# EAGLE design JunoCTRL 1.3 (EAGLE 6.1)
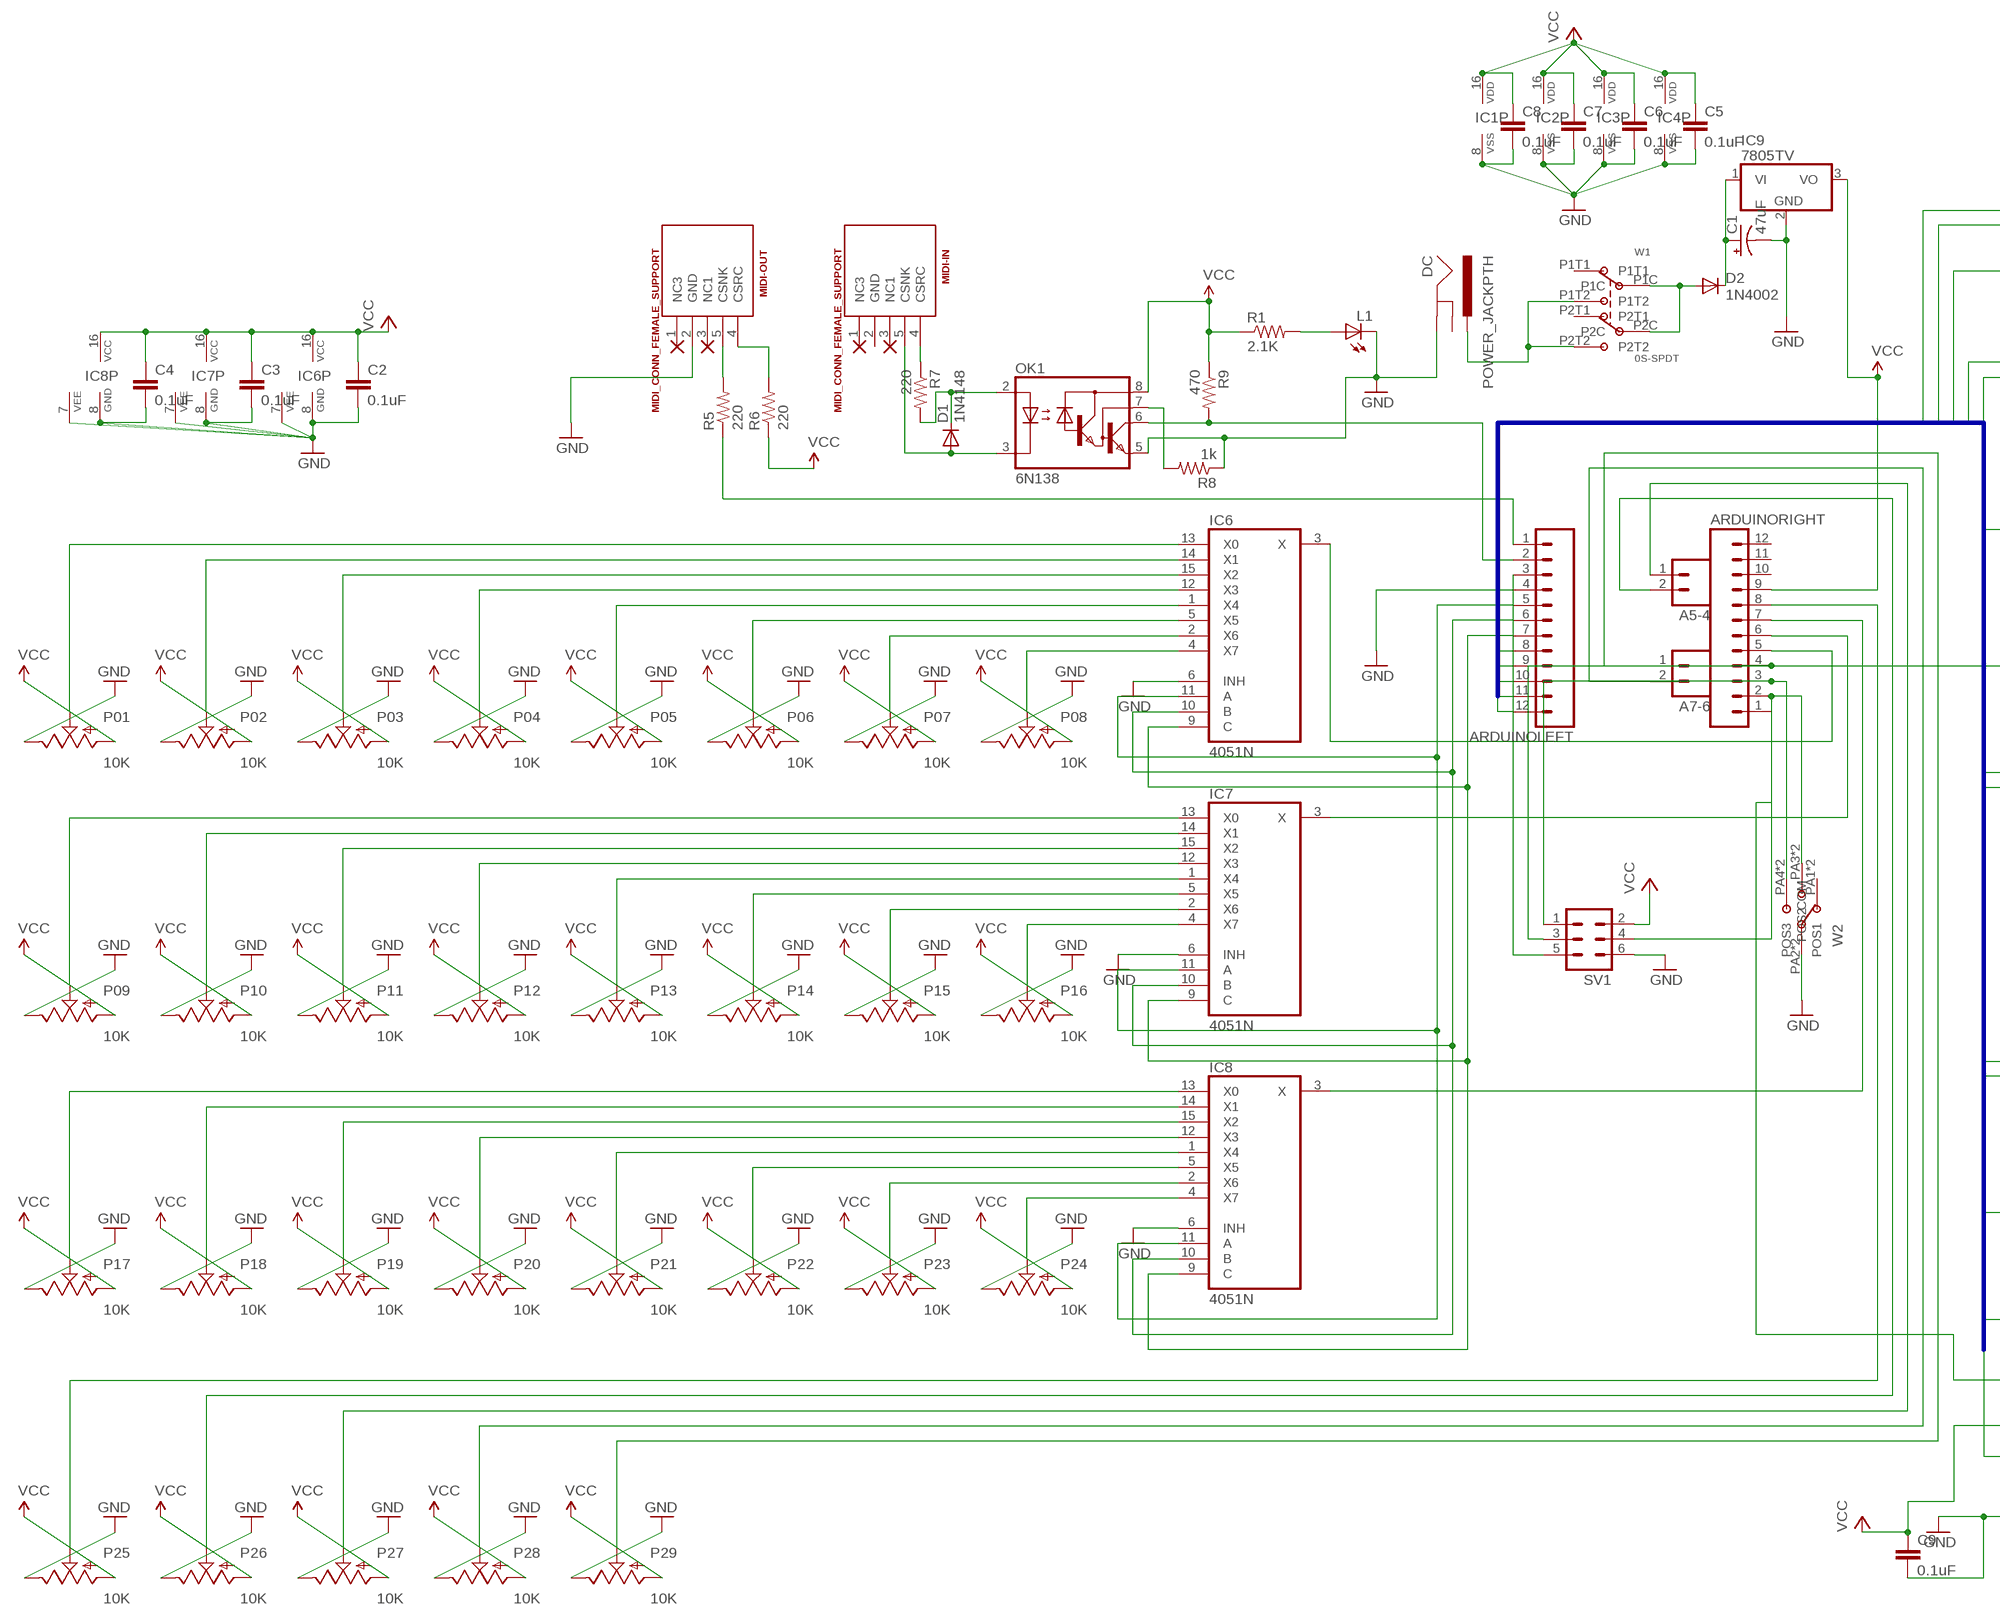
[diagram p0: schematic, sheet 1, part 1 of 2]
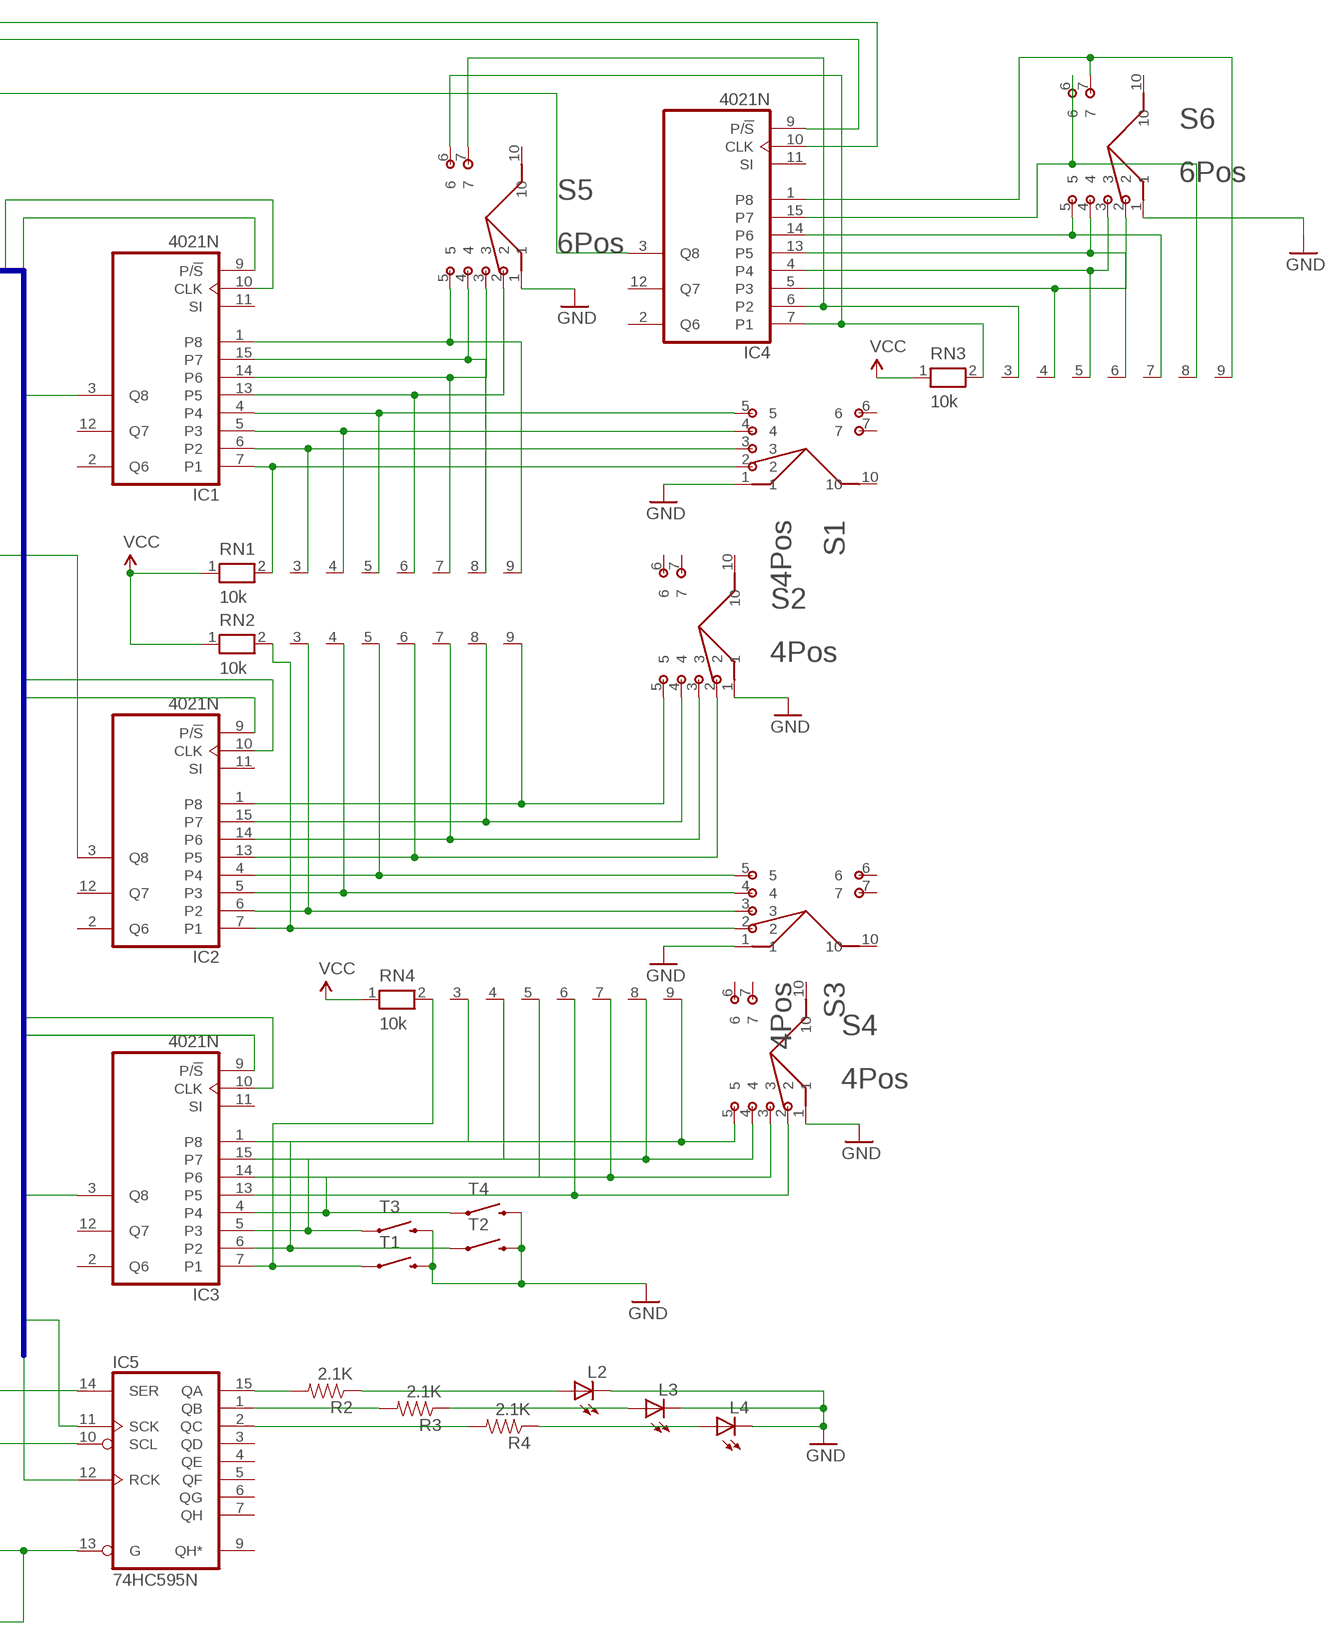
[diagram p1: schematic, sheet 1, part 2 of 2]

## Parts
A5-4  M02PTH  [1X02]
A7-6  M02PTH  [1X02]
ARDUINOLEFT  M12PTH  [1X12]
ARDUINORIGHT  M12PTH  [1X12]
C1  47uF  CAP_POLPTH1  [CPOL-RADIAL-100UF-25V]
C2  0.1uF  CAPPTH  [CAP-PTH-SMALL]
C3  0.1uF  CAPPTH  [CAP-PTH-SMALL]
C4  0.1uF  CAPPTH  [CAP-PTH-SMALL]
C5  0.1uF  CAPPTH  [CAP-PTH-SMALL]
C6  0.1uF  CAPPTH  [CAP-PTH-SMALL]
C7  0.1uF  CAPPTH  [CAP-PTH-SMALL]
C8  0.1uF  CAPPTH  [CAP-PTH-SMALL]
C9  0.1uF  CAPPTH  [CAP-PTH-SMALL]
D1  1N4148  1N4148DO35-7  [DO35-7]
D2  1N4002  1N4004  [DO41-7]
DC  POWER_JACKPTH  [POWER_JACK_PTH]
IC1  4021N  [DIL16]
IC2  4021N  [DIL16]
IC3  4021N  [DIL16]
IC4  4021N  [DIL16]
IC5  74HC595N  [DIL16]
IC6  4051N  [DIL16]
IC7  4051N  [DIL16]
IC8  4051N  [DIL16]
IC9  7805TV  [TO220V]
L1  LED3MM  [LED3MM]
L2  LED3MM  [LED3MM]
L3  LED3MM  [LED3MM]
L4  LED3MM  [LED3MM]
MIDI-IN  MIDI_CONN_FEMALE_SUPPORT  [DIN_5_FEMALE_SUPPORT]
MIDI-OUT  MIDI_CONN_FEMALE_SUPPORT  [DIN_5_FEMALE_SUPPORT]
OK1  6N138  [DIL08]
P01  10K  POT  [ALPS_POT]
P02  10K  POT  [ALPS_POT]
P03  10K  POT  [ALPS_POT]
P04  10K  POT  [ALPS_POT]
P05  10K  POT  [ALPS_POT]
P06  10K  POT  [ALPS_POT]
P07  10K  POT  [ALPS_POT]
P08  10K  POT  [ALPS_POT]
P09  10K  POT  [ALPS_POT]
P10  10K  POT  [ALPS_POT]
P11  10K  POT  [ALPS_POT]
P12  10K  POT  [ALPS_POT]
P13  10K  POT  [ALPS_POT]
P14  10K  POT  [ALPS_POT]
P15  10K  POT  [ALPS_POT]
P16  10K  POT  [ALPS_POT]
P17  10K  POT  [ALPS_POT]
P18  10K  POT  [ALPS_POT]
P19  10K  POT  [ALPS_POT]
P20  10K  POT  [ALPS_POT]
P21  10K  POT  [ALPS_POT]
P22  10K  POT  [ALPS_POT]
P23  10K  POT  [ALPS_POT]
P24  10K  POT  [ALPS_POT]
P25  10K  POT  [ALPS_POT]
P26  10K  POT  [ALPS_POT]
P27  10K  POT  [ALPS_POT]
P28  10K  POT  [ALPS_POT]
P29  10K  POT  [ALPS_POT]
R1  2.1K  RESISTORAXIAL-0.3  [AXIAL-0.3]
R2  2.1K  RESISTORAXIAL-0.3  [AXIAL-0.3]
R3  2.1K  RESISTORAXIAL-0.3  [AXIAL-0.3]
R4  2.1K  RESISTORAXIAL-0.3  [AXIAL-0.3]
R5  220  RESISTORAXIAL-0.3  [AXIAL-0.3]
R6  220  RESISTORAXIAL-0.3  [AXIAL-0.3]
R7  220  RESISTORAXIAL-0.3  [AXIAL-0.3]
R8  1k  RESISTORAXIAL-0.3  [AXIAL-0.3]
R9  470  RESISTORAXIAL-0.3  [AXIAL-0.3]
RN1  10k  RN08  [RN-9]
RN2  10k  RN08  [RN-9]
RN3  10k  RN08  [RN-9]
RN4  10k  RN08  [RN-9]
S1  4Pos  SRBV  [SRBV]
S2  4Pos  SRBV  [SRBV]
S3  4Pos  SRBV  [SRBV]
S4  4Pos  SRBV  [SRBV]
S5  6Pos  SRBV  [SRBV]
S6  6Pos  SRBV  [SRBV]
SV1  MA03-2  [MA03-2]
T1  SWITCH-MOMENTARY-212MM  [TACTILE-PTH-12MM]
T2  SWITCH-MOMENTARY-212MM  [TACTILE-PTH-12MM]
T3  SWITCH-MOMENTARY-212MM  [TACTILE-PTH-12MM]
T4  SWITCH-MOMENTARY-212MM  [TACTILE-PTH-12MM]
W1  0S-SPDT  [0S-SPDT]
W2  0S-SP3T  [0S-SP3T]

## Nets
GND: ARDUINOLEFT.4 C1.2(-) C2.2 C3.2 C4.2 C5.2 C6.2 C7.2 C8.2 C9.2 DC.GND IC1.8(VSS) IC2.8(VSS) IC3.8(VSS) IC4.8(VSS) IC5.13(G) IC6.6(INH) IC6.7(VEE) IC6.8(GND) IC7.6(INH) IC7.7(VEE) IC7.8(GND) IC8.6(INH) IC8.7(VEE) IC8.8(GND) IC9.2(GND) L1.K(C) L2.K(C) L3.K(C) L4.K(C) MIDI-OUT.2(GND) OK1.5(GND) P01.P$1(E) P02.P$1(E) P03.P$1(E) P04.P$1(E) P05.P$1(E) P06.P$1(E) P07.P$1(E) P08.P$1(E) P09.P$1(E) P10.P$1(E) P11.P$1(E) P12.P$1(E) P13.P$1(E) P14.P$1(E) P15.P$1(E) P16.P$1(E) P17.P$1(E) P18.P$1(E) P19.P$1(E) P20.P$1(E) P21.P$1(E) P22.P$1(E) P23.P$1(E) P24.P$1(E) P25.P$1(E) P26.P$1(E) P27.P$1(E) P28.P$1(E) P29.P$1(E) R8.P$1 S1.1 S2.1 S3.1 S4.1 S5.1 S6.1 SV1.6 T1.3 T2.3 T3.3 T4.3 W2.PA2(COM) W2.PA6(COM)
N$1: IC7.4(X7) P16.P$2(S)
N$2: IC6.4(X7) P08.P$2(S)
N$3: IC6.2(X6) P07.P$2(S)
N$4: IC6.5(X5) P06.P$2(S)
N$5: IC6.1(X4) P05.P$2(S)
N$6: IC6.12(X3) P04.P$2(S)
N$7: IC6.15(X2) P03.P$2(S)
N$8: IC6.14(X1) P02.P$2(S)
N$9: IC6.13(X0) P01.P$2(S)
N$10: IC7.2(X6) P15.P$2(S)
N$11: IC7.5(X5) P14.P$2(S)
N$12: IC7.1(X4) P13.P$2(S)
N$13: IC7.12(X3) P12.P$2(S)
N$14: IC7.15(X2) P11.P$2(S)
N$15: IC7.14(X1) P10.P$2(S)
N$16: IC7.13(X0) P09.P$2(S)
N$17: IC8.4(X7) P24.P$2(S)
N$18: IC8.2(X6) P23.P$2(S)
N$19: IC8.5(X5) P22.P$2(S)
N$20: IC8.1(X4) P21.P$2(S)
N$21: IC8.12(X3) P20.P$2(S)
N$22: IC8.15(X2) P19.P$2(S)
N$23: IC8.14(X1) P18.P$2(S)
N$24: IC8.13(X0) P17.P$2(S)
N$25: ARDUINORIGHT.8 P25.P$2(S)
N$26: A5-4.2 P26.P$2(S)
N$27: A5-4.1 P27.P$2(S)
N$28: A7-6.2 P28.P$2(S)
N$29: A7-6.1 P29.P$2(S)
N$30: ARDUINOLEFT.5 IC6.11(A) IC7.11(A) IC8.11(A)
N$31: ARDUINOLEFT.6 IC6.10(B) IC7.10(B) IC8.10(B)
N$32: ARDUINOLEFT.7 IC6.9(C) IC7.9(C) IC8.9(C)
N$33: ARDUINORIGHT.5 IC6.3(X)
N$34: ARDUINORIGHT.6 IC7.3(X)
N$35: ARDUINORIGHT.7 IC8.3(X)
N$36: IC1.7(P1) RN1.2 S1.2
N$37: IC1.6(P2) RN1.3 S1.3
N$38: IC1.5(P3) RN1.4 S1.4
N$39: IC1.4 RN1.5 S1.5
N$40: IC1.13(P5) RN1.6 S5.2
N$41: IC1.14(P6) RN1.7 S5.3
N$42: IC1.15(P7) RN1.8 S5.4
N$43: IC1.1(P8) RN1.9 S5.5
N$44: IC2.7(P1) RN2.2 S3.2
N$45: IC2.6(P2) RN2.3 S3.3
N$46: IC2.5(P3) RN2.4 S3.4
N$47: IC2.4 RN2.5 S3.5
N$48: IC2.13(P5) RN2.6 S2.2
N$49: IC2.14(P6) RN2.7 S2.3
N$50: IC2.15(P7) RN2.8 S2.4
N$51: IC2.1(P8) RN2.9 S2.5
N$52: OK1.7(VB) R8.P$2
N$53: IC4.7(P1) RN3.2 S5.6
N$54: IC4.6(P2) RN3.3 S5.7
N$55: IC4.5(P3) RN3.4 S6.2
N$56: IC4.4 RN3.5 S6.3
N$57: IC4.13(P5) RN3.6 S6.4
N$58: D2.A W1.P1C W1.P2C
N$59: IC4.14(P6) RN3.7 S6.5
N$60: IC4.15(P7) RN3.8 S6.6
N$61: ARDUINORIGHT.3 SV1.1 W2.PA4(POS3) W2.PA8(POS3)
N$62: L1.A R1.P$2
N$63: ARDUINORIGHT.2 SV1.4 W2.PA3(POS2) W2.PA7(POS2)
N$64: IC5.15(QA) R2.P$2
N$65: L2.A R2.P$1
N$66: ARDUINORIGHT.1 IC5.14(SER)
N$67: DC.PWR W1.P1T2 W1.P2T2
N$68: L3.A R3.P$1
N$69: ARDUINORIGHT.4 IC2.3(Q8) SV1.3
N$70: MIDI-IN.4(CSRC) R7.P$1
N$71: D1.A MIDI-IN.5(CSNK) OK1.3(C)
N$72: C1.1(+) D2.C IC9.1(VI)
N$73: ARDUINOLEFT.2 OK1.6(VO) R9.P$2
N$74: MIDI-OUT.5(CSNK) R5.P$2
N$75: ARDUINOLEFT.1 R5.P$1
N$76: MIDI-OUT.4(CSRC) R6.P$2
N$77: IC4.1(P8) RN3.9 S6.7
N$78: IC3.7(P1) RN4.2 T1.1
N$79: IC3.6(P2) RN4.3 T2.1
N$80: IC3.5(P3) RN4.4 T3.1
N$81: IC3.4 RN4.5 T4.1
N$82: IC5.1(QB) R3.P$2
N$83: IC5.2(QC) R4.P$2
N$84: L4.A R4.P$1
N$85: D1.C OK1.2(A) R7.P$2
N$86: IC3.13(P5) RN4.6 S4.2
N$87: IC3.14(P6) RN4.7 S4.3
N$88: IC3.15(P7) RN4.8 S4.4
N$89: IC3.1(P8) RN4.9 S4.5
N$90: ARDUINOLEFT.3 SV1.5
SR5: ARDUINOLEFT.8 IC1.3(Q8)
SR6: ARDUINOLEFT.9 IC1.9(P/!S) IC2.9(P/!S) IC3.9(P/!S) IC4.9(P/!S) IC5.12(RCK)
SR7: ARDUINOLEFT.10 IC1.10(CLK) IC2.10(CLK) IC3.10(CLK) IC4.10(CLK) IC5.11(SCK)
SR8: ARDUINOLEFT.11 IC3.3(Q8)
SR9: ARDUINOLEFT.12 IC4.3(Q8)
VCC: ARDUINORIGHT.9 C2.1 C3.1 C4.1 C5.1 C6.1 C7.1 C8.1 C9.1 IC1.16(VDD) IC2.16(VDD) IC3.16(VDD) IC4.16(VDD) IC5.10(SCL) IC6.16(VCC) IC7.16(VCC) IC8.16(VCC) IC9.3(VO) OK1.8(VCC) P01.P$3(A) P02.P$3(A) P03.P$3(A) P04.P$3(A) P05.P$3(A) P06.P$3(A) P07.P$3(A) P08.P$3(A) P09.P$3(A) P10.P$3(A) P11.P$3(A) P12.P$3(A) P13.P$3(A) P14.P$3(A) P15.P$3(A) P16.P$3(A) P17.P$3(A) P18.P$3(A) P19.P$3(A) P20.P$3(A) P21.P$3(A) P22.P$3(A) P23.P$3(A) P24.P$3(A) P25.P$3(A) P26.P$3(A) P27.P$3(A) P28.P$3(A) P29.P$3(A) R1.P$1 R6.P$1 R9.P$1 RN1.1 RN2.1 RN3.1 RN4.1 SV1.2
Unconnected: ARDUINORIGHT.10 ARDUINORIGHT.11 ARDUINORIGHT.12 DC.GNDBREAK IC1.2(Q6) IC1.11(SI) IC1.12(Q7) IC2.2(Q6) IC2.11(SI) IC2.12(Q7) IC3.2(Q6) IC3.11(SI) IC3.12(Q7) IC4.2(Q6) IC4.11(SI) IC4.12(Q7) IC5.3(QD) IC5.4(QE) IC5.5(QF) IC5.6(QG) IC5.7(QH) IC5.9(QH*) MIDI-IN.1(NC3) MIDI-IN.2(GND) MIDI-IN.3(NC1) MIDI-OUT.1(NC3) MIDI-OUT.3(NC1) S1.6 S1.7 S1.10 S2.6 S2.7 S2.10 S3.6 S3.7 S3.10 S4.6 S4.7 S4.10 S5.10 S6.10 W1.P1T1 W1.P2T1 W2.PA1(POS1) W2.PA5(POS1)

## Buses
SR[5..9]

## Power pins joined to a net without a drawn wire
GND: IC5.8(GND)
VCC: IC5.16(VCC)

## Library data of the parts
A5-4 A7-6 = SparkFun-Connectors:M02: Standard 2-pin 0.1" header. Use with - straight break away headers ( PRT-00116) - right angle break away headers (PRT-00553) - swiss pins (PRT-00743) - machine pins (PRT-00117) - female headers (PRT-00115) Molex polarized connector foot print use with: PRT-08233 with associated crimp pins and housings. 2.54_SCREWTERM for use with PRT-10571. 3.5mm Screw Terminal footprints for PRT-08084 5mm Screw Terminal footprints for use with PRT-08432
ARDUINOLEFT ARDUINORIGHT = SparkFun-Connectors:M12: Header 12 Standard 12-pin 0.1" header. Use with straight break away headers (SKU : PRT-00116), right angle break away headers (PRT-00553), swiss pins (PRT-00743), machine pins (PRT-00117), and female headers (PRT-00115).
C1 = SparkFun-Passives:CAP_POL: Capacitor Polarized These are standard SMD and PTH capacitors. Normally 10uF, 47uF, and 100uF in electrolytic and tantalum varieties. Always verify the external diameter of the through hole cap, it varies with capacity, voltage, and manufacturer. The EIA devices should be standard.
C2-C9 = SparkFun-Passives:CAP: Capacitor Standard 0603 ceramic capacitor, and 0.1" leaded capacitor.
D1 = diode:1N4148: DIODE high speed (Philips)
D2 = diode:1N4004: DIODE general purpose rectifier, 1 A
DC = SparkFun-Connectors:POWER_JACK: Power Jack This is the standard 5.5mm barrel jack for power. The PTH is the most common, proven, reliable, footprint. The Slot footprint only works if the mill layer is transmitted to the PCB fab house so be warned. Mating wall wart : TOL-00298 (and others); PROD_ID: CONN-08197
IC1-IC4 = 40xx:4021: 8-bit static SHIFT REGISTER
IC5 = 74xx-eu:74*595: 8-bit SHIFT REGISTER, output latch
IC6-IC8 = 40xx:4051: 8-channel ANALOG MULTIPLEXER
IC9 = linear:78*: Positive VOLTAGE REGULATOR Source: http://cache.national.com/ds/LM/LM78L05.pdf http://www.fairchildsemi.com/ds/LM/LM7805.pdf
L1-L4 = led:LED: LED OSRAM: - CHIPLED LG R971, LG N971, LY N971, LG Q971, LY Q971, LO R971, LY R971 LH N974, LH R974 LS Q976, LO Q976, LY Q976 LO Q996 - Hyper CHIPLED LW Q18S LB Q993, LB Q99A, LB R99A - SideLED LS A670, LO A670, LY A670, LG A670, LP A670 LB A673, LV A673, LT A673, LW A673 LH A674 LY A675 LS A676, LA A676, LO A676, LY A676, LW A676 LS A679, LY A679, LG A679 - Hyper Micro SIDELED® LS Y876, LA Y876, LO Y876, LY Y876 LT Y87S - SmartLED LW L88C, LW L88S LB L89C, LB L89S, LG L890 LS L89K, LO L89K, LY L89K LS L896, LA L896, LO L896, LY L896 - TOPLED LS T670, LO T670, LY T670, LG T670, LP T670 LSG T670, LSP T670, LSY T670, LOP T670, LYG T670 LG T671, LOG T671, LSG T671 LB T673, LV T673, LT T673, LW T673 LH T674 LS T676, LA T676, LO T676, LY T676, LB T676, LH T676, LSB T676, LW T676 LB T67C, LV T67C, LT T67C, LS T67K, LO T67K, LY T67K, LW E67C LS E67B, LA E67B, LO E67B, LY E67B, LB E67C, LV E67C, LT E67C LW T67C LS T679, LY T679, LG T679 LS T770, LO T770, LY T770, LG T770, LP T770 LB T773, LV T773, LT T773, LW T773 LH T774 LS E675, LA E675, LY E675, LS T675 LS T776, LA T776, LO T776, LY T776, LB T776 LHGB T686 LT T68C, LB T68C - Hyper Mini TOPLED® LB M676 - Mini TOPLED Santana® LG M470 LS M47K, LO M47K, LY M47K Source: http://www.osram.convergy.de LUXEON: - LUMILED® LXK2-PW12-R00, LXK2-PW12-S00, LXK2-PW14-U00, LXK2-PW14-V00 LXK2-PM12-R00, LXK2-PM12-S00, LXK2-PM14-U00 LXK2-PE12-Q00, LXK2-PE12-R00, LXK2-PE12-S00, LXK2-PE14-T00, LXK2-PE14-U00 LXK2-PB12-K00, LXK2-PB12-L00, LXK2-PB12-M00, LXK2-PB14-N00, LXK2-PB14-P00, LXK2-PB14-Q00 LXK2-PR12-L00, LXK2-PR12-M00, LXK2-PR14-Q00, LXK2-PR14-R00 LXK2-PD12-Q00, LXK2-PD12-R00, LXK2-PD12-S00 LXK2-PH12-R00, LXK2-PH12-S00 LXK2-PL12-P00, LXK2-PL12-Q00, LXK2-PL12-R00 Source: www.luxeon.com KINGBRIGHT: KA-3528ASYC Source: www.kingbright.com
MIDI-IN MIDI-OUT = SparkFun-Connectors:MIDI_CONN_FEMALE_SUPPORT: MIDI connector with strain relief (DIN-5 female)
OK1 = optocoupler:6N138: MOTOROLA OPTO COUPLER; MF: VISHAY/TELEFUNKEN; MPN: 6N138; OC_FARNELL: 9860150; OC_NEWARK: 35K5294
P01-P09 P10-P29 = SparkFun-Electromechanical:POT
R1-R9 = SparkFun-Passives:RESISTOR: Resistor Basic schematic elements and footprints for 0603, 1206, and PTH resistors.
RN1-RN4 = resistor-net:RN08: RESISTOR NETWORK; OC_FARNELL: unknown; OC_NEWARK: unknown
S1-S6 = JunoLib:SRBV: ALPS SRBV Switch
SV1 = con-lstb:MA03-2: PIN HEADER; OC_FARNELL: unknown; OC_NEWARK: unknown
T1-T4 = SparkFun-Electromechanical:SWITCH-MOMENTARY-2: Various NO switches- pushbuttons, reed, etc; PROD_ID: SWCH-09185
W1 = JunoLib:0S-SPDT: E-Switch EG 2208A DPDT Switch
W2 = JunoLib:0S-SP3T: E-Switch EG2310 DP3T

## Board
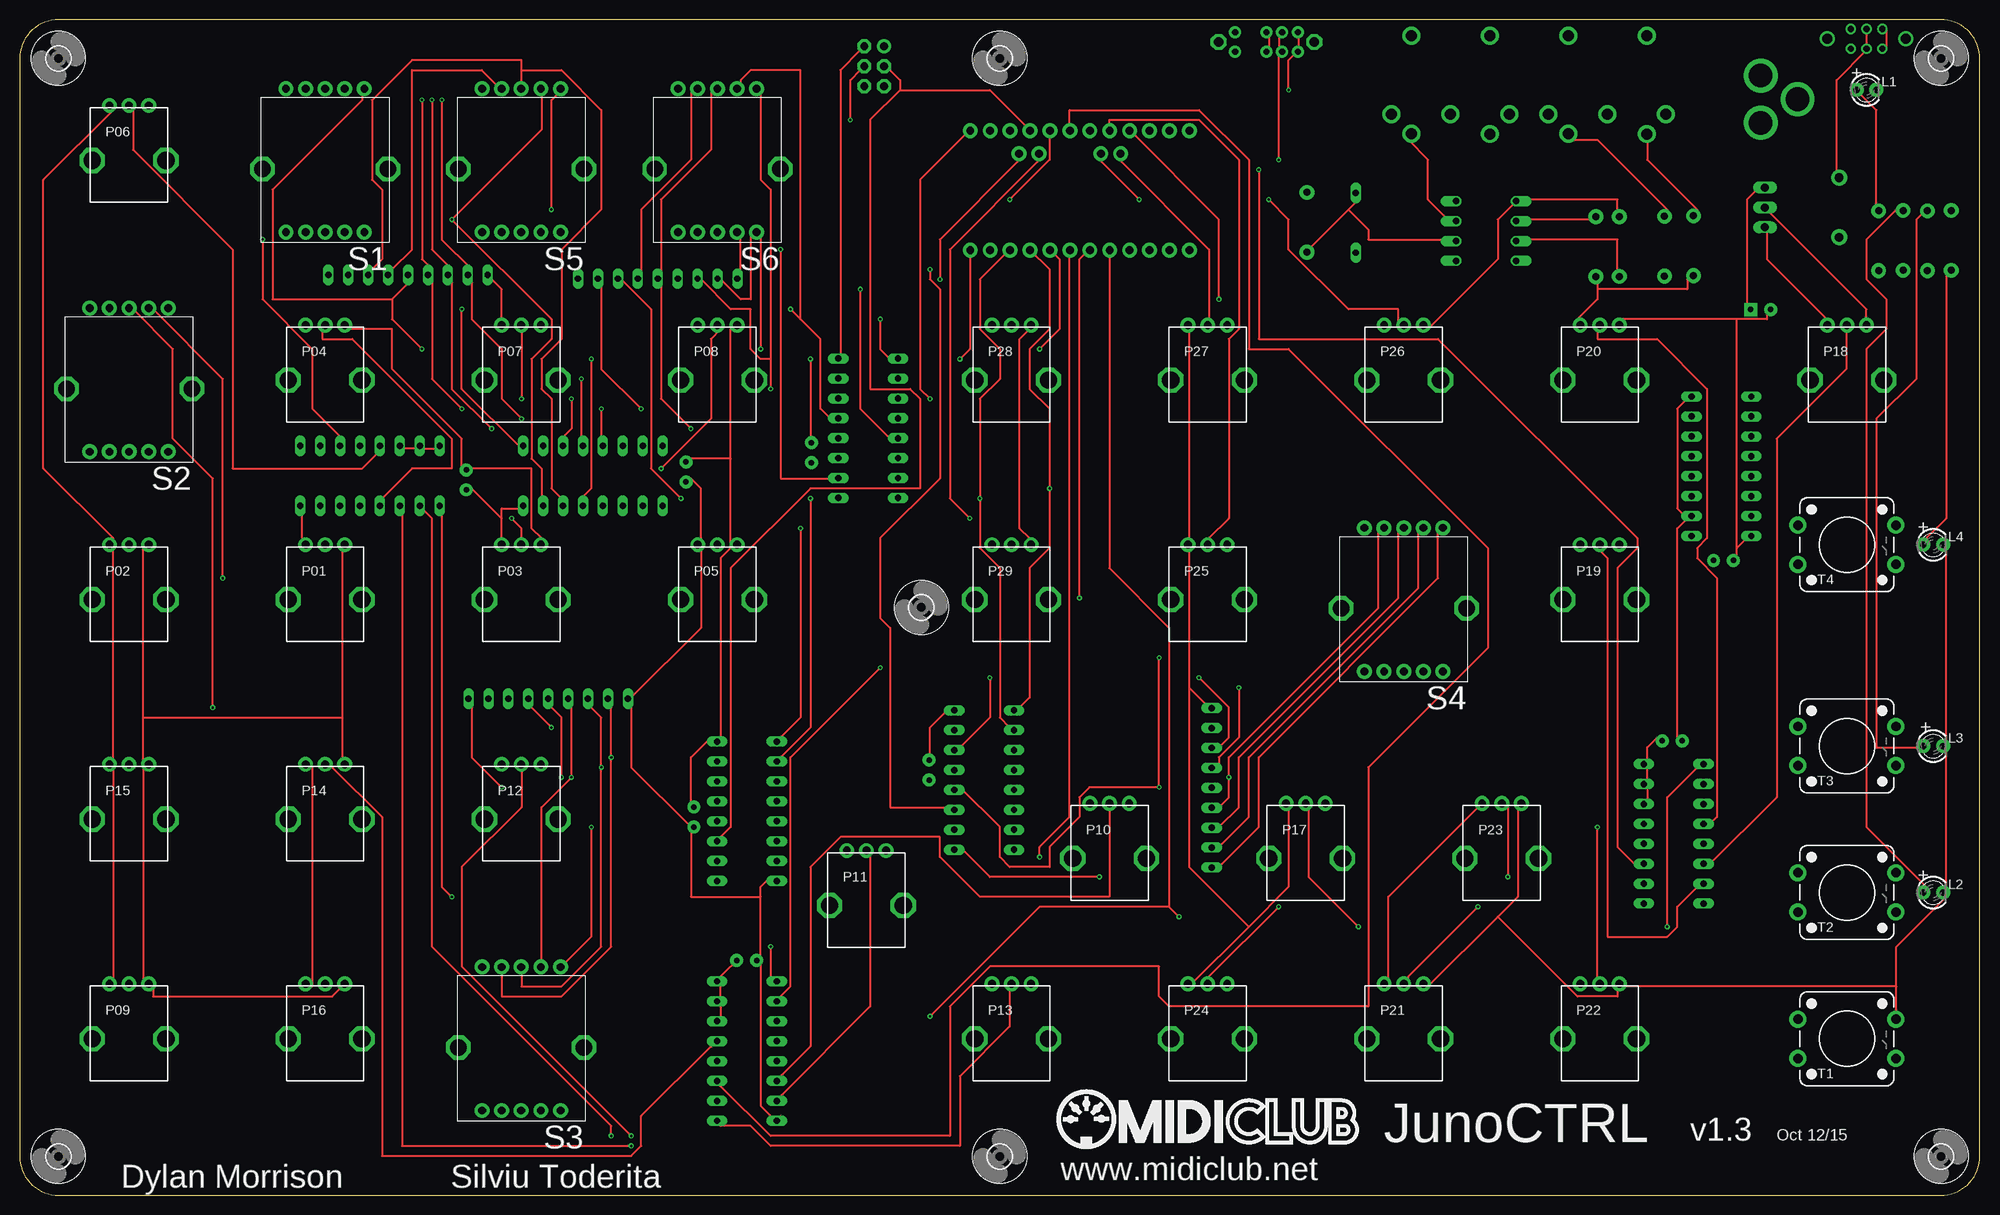
[diagram p2: board, top side]
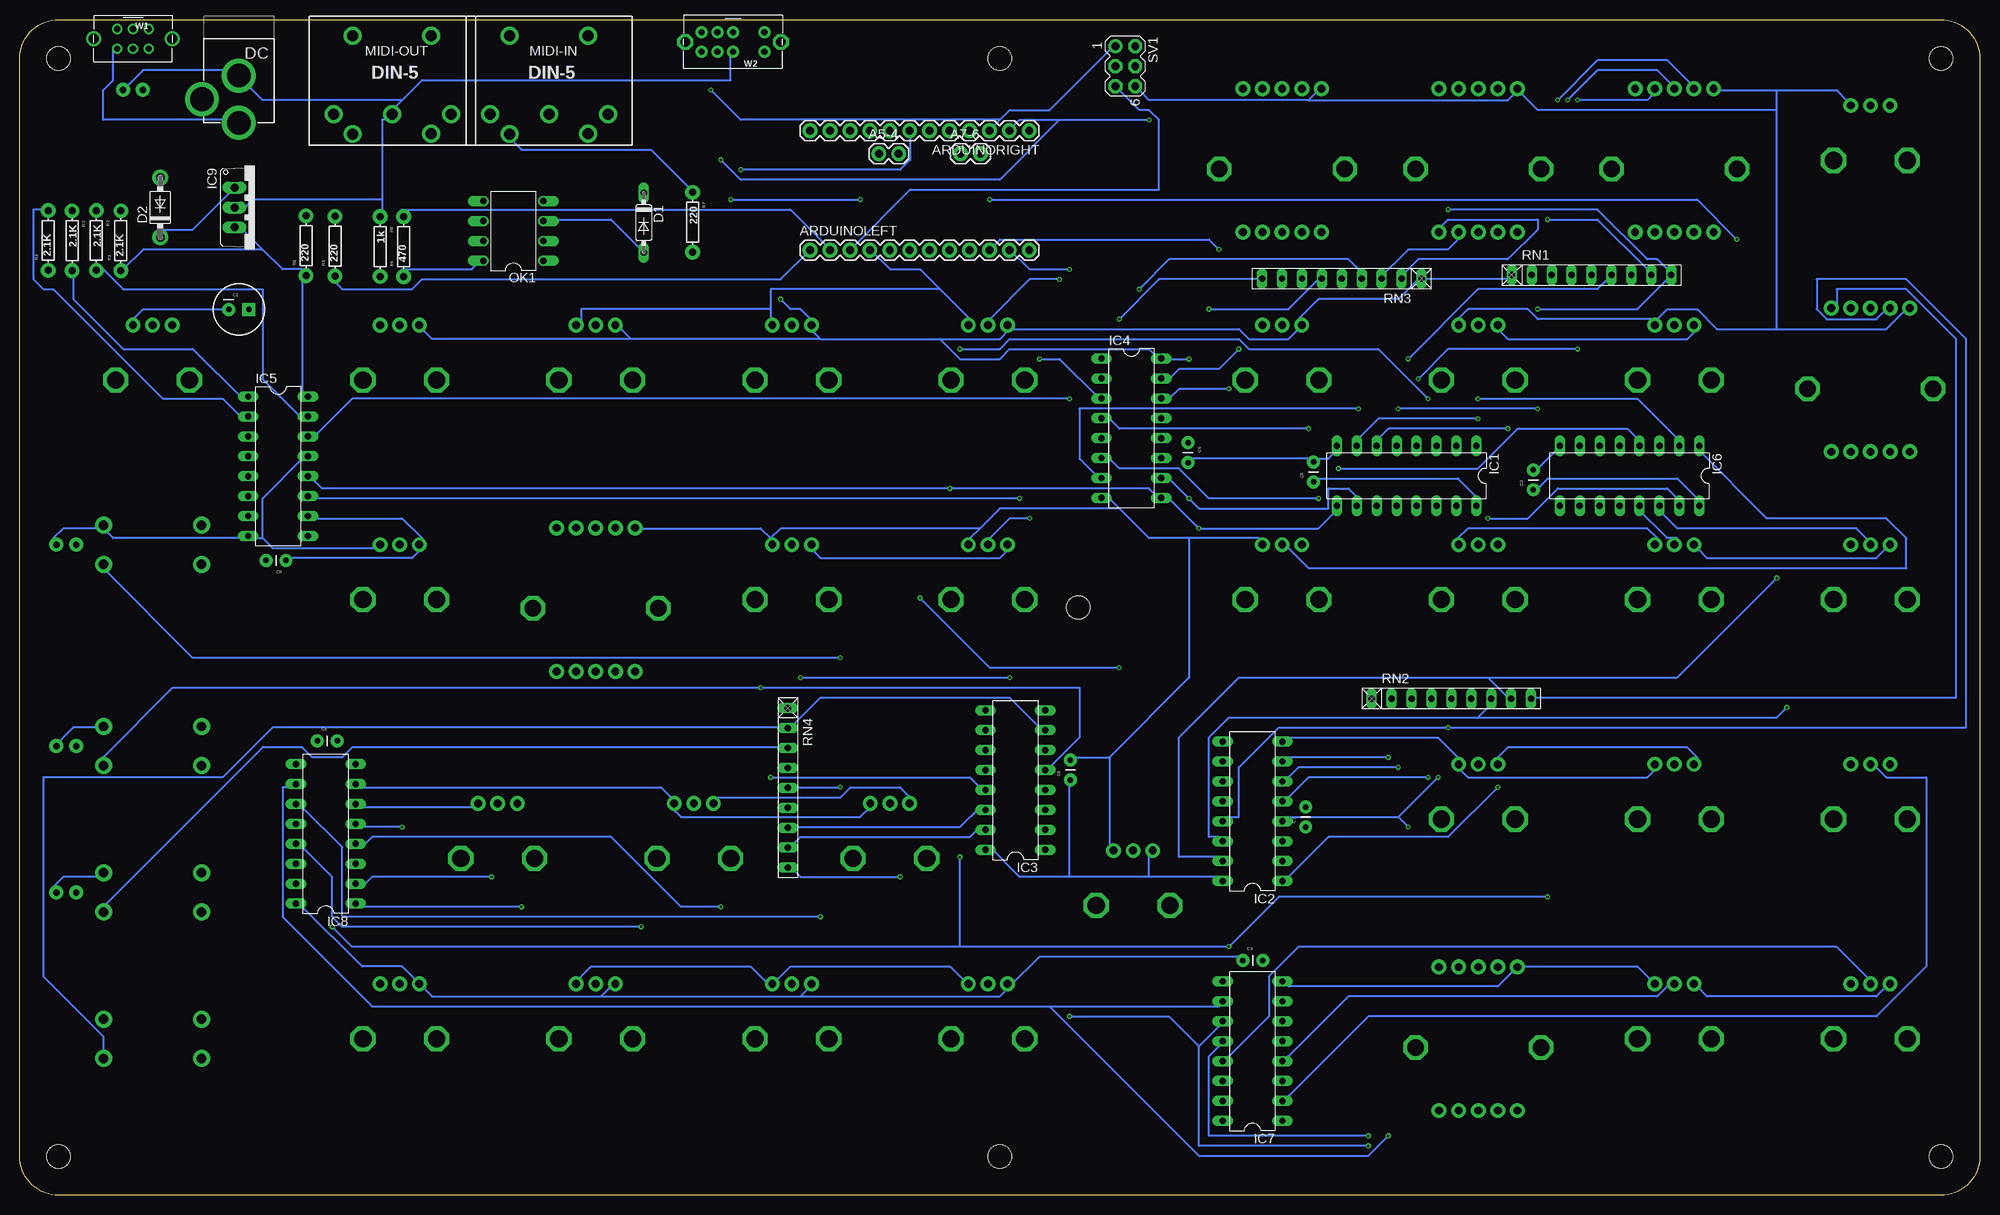
[diagram p3: board, bottom side, seen from below]

Size 249.9 x 149.9 mm. Coordinates in mm from the lower left corner, seen from the top.
Outline: 0,144.9 0,5 arc90 5,0 244.9,0 arc90 249.9,5 249.9,144.9 arc90 244.9,149.9 5,149.9 arc90 0,144.9
Copper layers (1*16): Top 0.035mm / dielectric 1.5mm / Bottom 0.035mm
Design rules: minimum track width 10mil, minimum drill 12mil, track to track 10mil, track to pad 10mil, pad to pad 10mil, via to via 10mil, smd to smd 0mil, copper to edge 10mil, drill to drill 10mil, minimum pad ring 10mil, minimum via ring 6mil, stop-mask expansion 2mil, vias tented up to drill 25mil, thermal gap 10mil

### Footprints (pad centres in the part's own frame; a part is rotated, then mirrored left to right if it is on the bottom)
1X02 = drill 1.016 pad 1.88: 1 0,0; 2 2.54,0
1X12 = drill 1.016 pad 1.88: 1 0,0; 2 2.54,0; 3 5.08,0; 4 7.62,0; 5 10.16,0; 6 12.7,0; 7 15.24,0; 8 17.78,0; 9 20.32,0; 10 22.86,0; 11 25.4,0; 12 27.94,0
CPOL-RADIAL-100UF-25V = drill 0.7 pad 1.651 square: 1 1.27,0 | drill 0.7 pad 1.651: 2 -1.27,0
CAP-PTH-SMALL = drill 0.7 pad 1.651: 1 0,0; 2 2.54,0
DO35-7 = drill 0.813 long: A 3.81,0; C -3.81,0
DO41-7 = drill 1.118 pad 2.032: A 3.81,0; C -3.81,0
POWER_JACK_PTH = drill 2.997 pad 4.318: GND 0,7.7; GNDBREAK 4.7,10.7; PWR 0,13.7
DIL16 = drill 0.813 long: 1 -8.89,-3.81; 2 -6.35,-3.81; 3 -3.81,-3.81; 4 -1.27,-3.81; 5 1.27,-3.81; 6 3.81,-3.81; 7 6.35,-3.81; 8 8.89,-3.81; 9 8.89,3.81; 10 6.35,3.81; 11 3.81,3.81; 12 1.27,3.81; 13 -1.27,3.81; 14 -3.81,3.81; 15 -6.35,3.81; 16 -8.89,3.81
TO220V = drill 1.016 long: 1 -2.54,-2.54; 2 0,-2.54; 3 2.54,-2.54
LED3MM = drill 0.813 pad 1.778: A -1.27,0; K 1.27,0
DIN_5_FEMALE_SUPPORT = drill 1.4 pad 2.286: 1 7.94,3.6; 2 0.46,3.61; 3 -7.07,3.6; 4 5.47,6.13; 5 -4.53,6.12; 6 -4.53,-6.382; 7 5.478,-6.382
DIL08 = drill 0.813 offset: 1 -3.81,-3.81; 2 -1.27,-3.81; 3 1.27,-3.81; 4 3.81,-3.81; 5 3.81,3.81; 6 1.27,3.81; 7 -1.27,3.81; 8 -3.81,3.81
ALPS_POT = drill 1 pad 1.88: P$1 7,-2.5; P$2 7,0; P$3 7,2.5 | drill 2.2 octagon: P$4 0,-4.7; P$5 0,4.7
AXIAL-0.3 = drill 0.9 pad 1.88: P$1 -3.81,0; P$2 3.81,0
RN-9 = drill 0.813 long: 1 -10.16,0; 2 -7.62,0; 3 -5.08,0; 4 -2.54,0; 5 0,0; 6 2.54,0; 7 5.08,0; 8 7.62,0; 9 10.16,0
SRBV = drill 1 pad 1.905: 1 5,-9.15; 2 2.5,-9.15; 3 0,-9.15; 4 -2.5,-9.15; 5 -5,-9.15; 6 -5,9.15; 7 -2.5,9.15; 8 0,9.15; 9 2.5,9.15; 10 5,9.15 | drill 2.1 octagon: P$11 -8,1.1; P$12 8,1.1
MA03-2 = drill 1.016 pad 1.778: 1 -2.54,-1.27 | drill 1.016 pad 1.778 octagon: 2 -2.54,1.27; 3 0,-1.27; 4 0,1.27; 5 2.54,-1.27; 6 2.54,1.27
TACTILE-PTH-12MM = drill 1.2 pad 2.159: 1 6.25,-2.5; 2 -6.25,-2.5; 3 6.25,2.5; 4 -6.25,2.5
3,0 = hole 3: 0,0
0S-SPDT = drill 1.25: LEFT -5,0; RIGHT 5,0 | drill 0.8: P1C 0,1.25; P1T1 -2,1.25; P1T2 2,1.25; P2C 0,-1.25; P2T1 -2,-1.25; P2T2 2,-1.25
0S-SP3T = drill 1.2 pad 2.032 octagon: LEFT -6.1,0; RIGHT 6.1,0 | drill 0.8 pad 1.524: PA1 -4,-1.25; PA2 0,-1.25; PA3 2,-1.25; PA4 4,-1.25; PA5 -4,1.25; PA6 0,1.25; PA7 2,1.25; PA8 4,1.25

### Placement (x,y rotation side)
A5-4  140.37,132.81 0 bottom
A7-6  129.95,132.81 0 bottom
ARDUINOLEFT  149.13,120.49 0 bottom
ARDUINORIGHT  121.19,135.73 180 bottom
C1  221.95,112.95 0 bottom
C2  56.95,89.95 90 bottom
C3  93.95,29.95 0 bottom
C4  211.95,57.95 0 bottom
C5  100.95,95.95 270 bottom
C6  115.95,52.95 90 bottom
C7  85.95,46.95 90 bottom
C8  84.95,90.95 90 bottom
C9  215.95,80.95 180 bottom
D1  170.34,124 270 bottom
D2  231.95,125.95 90 bottom
DC  221.95,150.45 180 bottom
IC1  73.08,91.73 180 bottom
IC2  92.73,48.96 90 bottom
IC3  122.95,52.95 90 bottom
IC4  108.17,97.8 270 bottom
IC5  216.95,92.95 270 bottom
IC6  44.66,91.73 180 bottom
IC7  92.73,18.38 90 bottom
IC8  210.87,46.08 90 bottom
IC9  219.95,125.95 270 bottom
L1  235.45,140.95 0 top
L2  243.95,38.61 0 top
L3  243.95,57.28 0 top
L4  243.95,82.95 0 top
MIDI-IN  181.95,141.45 180 bottom
MIDI-OUT  201.95,141.45 180 bottom
OK1  186.95,122.95 90 bottom
P01  38.95,75.95 90 top
P02  13.95,75.95 90 top
P03  63.95,75.95 90 top
P04  38.95,103.95 90 top
P05  88.95,75.95 90 top
P06  13.95,131.95 90 top
P07  63.95,103.95 90 top
P08  88.95,103.95 90 top
P09  13.95,19.95 90 top
P10  138.95,42.95 90 top
P11  107.95,36.95 90 top
P12  63.95,47.95 90 top
P13  126.45,19.95 90 top
P14  38.95,47.95 90 top
P15  13.95,47.95 90 top
P16  38.95,19.95 90 top
P17  163.95,42.95 90 top
P18  232.95,103.95 90 top
P19  201.45,75.95 90 top
P20  201.45,103.95 90 top
P21  176.45,19.95 90 top
P22  201.45,19.95 90 top
P23  188.95,42.95 90 top
P24  151.45,19.95 90 top
P25  151.45,75.95 90 top
P26  176.45,103.95 90 top
P27  151.45,103.95 90 top
P28  126.45,103.95 90 top
P29  126.45,75.95 90 top
R1  236.99,121.71 90 bottom
R2  240.11,121.75 270 bottom
R3  243.21,121.71 270 bottom
R4  246.25,121.75 90 bottom
R5  209.69,121.01 90 bottom
R6  213.39,121.07 90 bottom
R7  164.11,124.07 270 bottom
R8  203.95,120.96 270 bottom
R9  200.95,120.95 90 bottom
RN1  49.51,117.33 0 bottom
RN2  67.38,63.33 0 bottom
RN3  81.35,116.87 180 bottom
RN4  151.95,51.95 270 bottom
S1  38.95,131.95 180 top
S2  13.95,103.95 180 top
S3  63.95,19.95 180 top
S4  176.45,75.95 180 top
S5  63.95,131.95 180 top
S6  88.95,131.95 180 top
SV1  108.95,143.95 270 bottom
T1  232.95,19.95 0 top
T2  232.95,38.61 0 top
T3  232.95,57.28 0 top
T4  232.95,82.95 0 top
U$1  [3,0]  4.95,4.95 0 top
U$2  [3,0]  244.95,4.95 0 top
U$3  [3,0]  4.95,144.95 0 top
U$4  [3,0]  244.95,144.95 0 top
U$5  [3,0]  124.95,144.95 0 top
U$6  [3,0]  124.95,4.95 0 top
U$7  [3,0]  114.95,74.95 0 top
W1  235.45,147.45 180 bottom
W2  158.95,147.05 180 bottom

### Tracks (layer width: path | path; a pad name or v marks a point on that pad's centre or on a via)
GND
  Top 0.254: IC9.2 222.74,125.68 235.44,112.98 235.44,111.71 P18.P$1 | 218.93,111.71 222.74,111.71 222.74,112.98 C1.2 | 218.93,111.71 203.69,111.71 P20.P$1 | 190.99,126.95 203.69,126.95 203.69,125.68 R8.P$1 | W2.PA6 159.24,146 159.24,148.54 W2.PA2 | 190.99,126.95 188.45,124.41 188.45,119.33 179.56,110.44 P26.P$1 | 190.99,126.95 OK1.5 | 207.5,52.02 207.5,49.48 IC8.6 | 207.5,52.02 207.5,54.56 | 207.5,52.02 IC8.7 | 207.5,54.56 207.5,57.1 208.77,58.37 C4.2 | 207.5,54.56 IC8.8 | 188.45,35.51 190.99,38.05 190.99,49.48 P23.P$1 | 188.45,35.51 179.56,26.62 P21.P$1 | 218.93,82.5 220.2,83.77 IC5.8 | 218.93,82.5 218.93,81.23 C9.2 | 239.25,26.62 203.69,26.62 | 239.25,26.62 239.25,22.81 T1.3 | 239.25,26.62 239.25,31.7 245.6,38.05 L2.K 245.6,39.32 245.6,57.1 | 245.6,57.1 245.6,82.5 L4.K | 245.6,57.1 L3.K | 188.45,35.51 198.61,25.35 203.69,25.35 203.69,26.62 | 203.69,26.62 P22.P$1 | 218.93,82.5 218.93,111.71 | 51.29,95.2 48.75,95.2 IC6.6 | 51.29,95.2 53.83,95.2 IC6.8 | 51.29,95.2 IC6.7 | P04.P$1 41.13,110.44 47.48,110.44 47.48,105.36 56.37,96.47 56.37,92.66 C2.2 57.64,92.66 65.26,92.66 65.26,85.04 66.53,83.77 P03.P$1 | IC7.6 89.39,22.81 89.39,24.08 IC7.7 89.39,25.35 89.39,26.62 IC7.8 89.39,27.89 91.93,30.43 C3.2 | 41.13,60.91 41.13,82.5 P01.P$1 | 41.13,60.91 41.13,55.83 P14.P$1 | 15.73,54.56 15.73,26.62 P09.P$1 17,26.62 17,25.35 39.86,25.35 41.13,26.62 P16.P$1 | 15.73,54.56 15.73,60.91 | 15.73,60.91 15.73,82.5 P02.P$1 | 15.73,54.56 P15.P$1 | 15.73,60.91 41.13,60.91 | C7.2 85.58,49.48 85.58,55.83 88.12,58.37 IC2.8 89.39,58.37 89.39,81.23 90.66,82.5 | IC3.8 118.6,62.18 116.06,59.64 116.06,55.83 C6.2 | 90.66,82.5 90.66,93.93
  Top 0.254: 90.66,93.93 90.66,110.44 P08.P$1 | 90.66,93.93 85.58,93.93 C8.2 | 90.66,82.5 P05.P$1 | P28.P$1 128.76,110.44 127.49,109.17 127.49,85.04 128.76,83.77 P29.P$1
  Bottom 0.254: 132.57,115.52 135.11,118.06 138.92,118.06 141.46,120.6 ARDUINOLEFT.4 | 132.57,115.52 128.76,111.71 P28.P$1 | 154.16,112.98 154.16,115.52 132.57,115.52 | 154.16,112.98 154.16,111.71 P27.P$1 | 154.16,112.98 178.29,112.98 178.29,110.44 P26.P$1 | C1.2 224.01,112.98 234.17,112.98 235.44,111.71 P18.P$1 | L1.K 236.71,140.92 234.17,143.46 222.74,143.46 DC.GND 221.47,142.19 218.93,139.65 201.15,139.65 | 201.15,139.65 202.42,138.38 MIDI-OUT.2 202.42,137.11 203.69,137.11 203.69,126.95 | 201.15,139.65 198.61,142.19 159.24,142.19 159.24,146 W2.PA6 | 203.69,126.95 203.69,125.68 R8.P$1 | 203.69,126.95 220.2,126.95 221.47,125.68 IC9.2 | P10.P$1 141.46,49.48 142.73,48.21 165.59,48.21 166.86,49.48 P17.P$1 166.86,50.75 168.13,52.02 206.23,52.02 IC8.7 | 154.16,26.62 151.62,29.16 131.3,29.16 128.76,26.62 P13.P$1 | IC8.6 206.23,49.48 192.26,49.48 P23.P$1 | 154.16,26.62 156.7,29.16 177.02,29.16 179.56,26.62 P21.P$1 | 154.16,26.62 P24.P$1 | 239.25,85.04 244.33,85.04 245.6,83.77 L4.K | 218.93,83.77 218.93,88.85 213.85,93.93 IC5.13 | 218.93,83.77 220.2,83.77 IC5.8 221.47,83.77 237.98,83.77 239.25,85.04 | 218.93,83.77 217.66,82.5 203.69,82.5 P19.P$1 | 239.25,85.04 T4.3 | L3.K 245.6,57.1 243.06,59.64 239.25,59.64 T3.3 | L2.K 245.6,39.32 244.33,40.59 239.25,40.59 T2.3 | 85.58,139.65 105.9,139.65 107.17,140.92 SV1.6 | 85.58,139.65 84.31,140.92 S6.1 | 58.91,140.92 60.18,139.65 85.58,139.65 | 25.89,140.92 33.51,140.92 S1.1 | 25.89,140.92 18.27,140.92 17,139.65 P06.P$1 | C2.2 56.37,92.66 53.83,95.2 IC6.8 | 41.13,111.71 56.37,111.71 57.64,112.98 65.26,112.98 66.53,111.71 P07.P$1 | 25.89,110.44 33.51,110.44 36.05,112.98 39.86,112.98 41.13,111.71
  Bottom 0.254: 25.89,110.44 11.92,110.44 9.38,112.98 S2.1 | 41.13,111.71 P04.P$1 | 25.89,110.44 25.89,138.38 | 25.89,138.38 25.89,140.92 | 58.91,140.92 56.37,138.38 25.89,138.38 | 58.91,140.92 S5.1 | 58.91,29.16 43.67,29.16 41.13,26.62 P16.P$1 | 58.91,29.16 61.45,26.62 88.12,26.62 IC7.8 | 58.91,29.16 S3.1 | P03.P$1 66.53,83.77 65.26,85.04 42.4,85.04 41.13,83.77 P01.P$1 | IC2.8 88.12,58.37 69.07,58.37 66.53,55.83 P12.P$1 66.53,54.56 65.26,53.29 42.4,53.29 41.13,54.56 P14.P$1 | 110.98,55.83 110.98,44.4 P11.P$1 | 110.98,55.83 116.06,55.83 C6.2 | 154.16,83.77 155.43,85.04 170.67,85.04 S4.1 | IC1.8 81.77,95.2 83.04,93.93 84.31,93.93 C8.2 85.58,93.93 100.82,93.93 C5.2 | 109.71,87.58 105.9,83.77 100.82,83.77 | 109.71,87.58 110.98,88.85 IC4.8 | 100.82,83.77 91.93,83.77 P05.P$1 | 127.49,85.04 124.95,87.58 109.71,87.58 | 127.49,85.04 128.76,83.77 P29.P$1 | 154.16,83.77 152.89,85.04 127.49,85.04 | 154.16,83.77 P25.P$1 | 110.98,55.83 100.82,65.99 100.82,83.77
N$1
  Bottom 0.254: IC7.4 88.12,17.73 80.5,25.35 41.13,25.35 39.86,26.62 P16.P$2
N$2  (via drill 0.3)
  Top 0.254: v81.77,92.66 88.12,99.01 88.12,109.17 89.39,110.44 P08.P$2
  Bottom 0.254: v81.77,92.66 63.99,92.66 58.91,97.74 44.94,97.74 43.67,96.47 IC6.4
N$3  (via drill 0.3)
  Top 0.254: v63.99,101.55 63.99,110.44 P07.P$2
  Bottom 0.254: v63.99,101.55 43.67,101.55 38.59,96.47 IC6.2
N$4
  Top 0.254: IC6.5 46.21,95.2 43.67,92.66 27.16,92.66 27.16,120.6 14.46,133.3 14.46,138.38 P06.P$2
N$5
  Bottom 0.254: IC6.1 36.05,95.2 27.16,86.31 11.92,86.31 9.38,83.77 9.38,79.96 85.58,79.96 88.12,82.5 P05.P$2
N$6
  Top 0.254: IC6.12 46.21,88.85 50.02,92.66 55.1,92.66 55.1,96.47 42.4,109.17 38.59,109.17 38.59,110.44 P04.P$2
N$7  (via drill 0.3)
  Top 0.254: v62.72,86.31 63.99,85.04 63.99,83.77 P03.P$2
  Bottom 0.254: v62.72,86.31 57.64,86.31 53.83,90.12 39.86,90.12 38.59,88.85 IC6.15
N$8
  Bottom 0.254: IC6.14 41.13,87.58 38.59,85.04 15.73,85.04 13.19,82.5 P02.P$2
N$9
  Bottom 0.254: IC6.13 43.67,87.58 39.86,83.77 38.59,83.77 P01.P$2
N$10
  Bottom 0.254: IC7.2 88.12,12.65 77.96,22.81 13.19,22.81 6.84,29.16 6.84,53.29 11.92,53.29 13.19,54.56 P15.P$2
N$11
  Top 0.254: IC7.5 88.12,19 79.23,10.11 79.23,6.3 77.96,5.03 46.21,5.03 46.21,48.21 39.86,54.56 P14.P$2
N$12
  Top 0.254: IC7.1 89.39,8.84 93.2,8.84 95.74,6.3 119.87,6.3 119.87,15.19 126.22,21.54 126.22,26.62 P13.P$2
N$13  (via drill 0.3)
  Top 0.254: v77.96,7.57 56.37,29.16 56.37,41.86 63.99,49.48 63.99,54.56 P12.P$2
  Bottom 0.254: v77.96,7.57 98.28,7.57 98.28,17.73 97.01,19 IC7.12
N$14
  Top 0.254: IC7.15 97.01,12.65 108.44,24.08 108.44,43.13 P11.P$2
N$15
  Top 0.254: IC7.14 97.01,15.19 100.82,19 100.82,41.86 104.63,45.67 117.33,45.67 117.33,43.13 122.41,38.05 138.92,38.05 138.92,49.48 P10.P$2
N$16
  Bottom 0.254: IC7.13 95.74,17.73 90.66,22.81 90.66,27.89 86.85,31.7 18.27,31.7 13.19,26.62 P09.P$2
N$17  (via drill 0.3)
  Top 0.254: v160.51,36.78 151.62,27.89 151.62,26.62 P24.P$2
  Bottom 0.254: v160.51,36.78 165.59,36.78 174.48,45.67 204.96,45.67 206.23,44.4 IC8.4
N$18  (via drill 0.3)
  Top 0.254: v189.72,40.59 189.72,49.48 P23.P$2
  Bottom 0.254: v189.72,40.59 204.96,40.59 206.23,39.32 IC8.2
N$19  (via drill 0.3)
  Top 0.254: v201.15,46.94 201.15,26.62 P22.P$2
  Bottom 0.254: v201.15,46.94 206.23,46.94 IC8.5
N$20  (via drill 0.3)
  Top 0.254: v185.91,36.78 177.02,27.89 177.02,26.62 P21.P$2
  Bottom 0.254: v185.91,36.78 206.23,36.78 IC8.1
N$21
  Top 0.254: IC8.12 215.12,46.94 216.39,48.21 216.39,78.69 213.85,81.23 213.85,82.5 215.12,83.77 215.12,102.82 208.77,109.17 201.15,109.17 201.15,110.44 P20.P$2
N$22
  Top 0.254: IC8.15 213.85,39.32 211.31,36.78 211.31,34.24 210.04,32.97 202.42,32.97 202.42,81.23 201.15,82.5 P19.P$2
N$23
  Top 0.254: IC8.14 215.12,41.86 224.01,50.75 224.01,96.47 232.9,105.36 232.9,110.44 P18.P$2
N$24  (via drill 0.3)
  Top 0.254: v170.67,34.24 164.32,40.59 164.32,49.48 P17.P$2
  Bottom 0.254: v170.67,34.24 208.77,34.24 210.04,35.51 210.04,40.59 213.85,44.4 IC8.13
N$25
  Top 0.254: P25.P$2 151.62,83.77 154.16,86.31 154.16,109.17 155.43,110.44 155.43,132.03 150.35,137.11 138.92,137.11 138.92,135.84 ARDUINORIGHT.8
N$26  (via drill 0.3)
  Top 0.254: v142.73,126.95 137.65,132.03 A5-4.2 | v159.24,126.95 161.78,124.41 161.78,120.6 169.4,112.98 175.75,112.98 175.75,110.44 P26.P$2
  Bottom 0.254: v159.24,126.95 v142.73,126.95
N$27
  Top 0.254: P27.P$2 151.62,111.71 151.62,120.6 140.19,132.03 A5-4.1
N$28  (via drill 0.3)
  Top 0.254: v117.33,116.79 117.33,121.87 127.49,132.03 A7-6.2
  Bottom 0.254: v117.33,116.79 121.14,116.79 126.22,111.71 P28.P$2
N$29  (via drill 0.3)
  Top 0.254: v121.14,86.31 118.6,88.85 118.6,120.6 130.03,132.03 A7-6.1
  Bottom 0.254: v121.14,86.31 123.68,86.31 126.22,83.77 P29.P$2
N$30  (via drill 0.3)
  Top 0.254: v77.96,6.3 48.75,6.3 48.75,87.58 IC6.11 | 146.54,36.78 v147.81,35.51 | 146.54,36.78 146.54,72.34 138.92,79.96 138.92,120.6 ARDUINOLEFT.5 | v116.06,22.81 130.03,36.78 146.54,36.78
  Bottom 0.254: 99.55,19 97.01,21.54 IC7.11 | 99.55,19 99.55,6.3 v77.96,6.3 | v147.81,35.51 208.77,35.51 208.77,44.4 213.85,49.48 IC8.11 | 99.55,19 103.36,22.81 v116.06,22.81
N$31  (via drill 0.3)
  Top 0.254: v75.42,7.57 75.42,8.84 52.56,31.7 52.56,86.31 51.29,87.58 IC6.10 | v135.11,76.15 135.11,119.33 136.38,120.6 ARDUINOLEFT.6 | v109.71,67.26 98.28,55.83 98.28,26.62 97.01,25.35 IC7.10
  Bottom 0.254: 118.6,24.08 204.96,24.08 216.39,35.51 216.39,52.02 215.12,52.02 IC8.10 | 118.6,24.08 97.01,24.08 IC7.10 | v75.42,7.57 77.96,5.03 99.55,5.03 118.6,24.08 | v135.11,76.15 126.22,67.26 v109.71,67.26
N$32  (via drill 0.3)
  Top 0.254: v95.74,31.7 95.74,27.89 IC7.9 | v55.1,38.05 53.83,39.32 53.83,87.58 IC6.9 | v210.04,34.24 210.04,50.75 213.85,54.56 IC8.9 | v130.03,43.13 130.03,44.4 133.84,48.21 133.84,120.6 ARDUINOLEFT.7
  Bottom 0.254: v55.1,38.05 89.39,38.05 v95.74,31.7 130.03,31.7 | v210.04,34.24 207.5,31.7 130.03,31.7 | 130.03,31.7 v130.03,43.13
N$33  (via drill 0.3)
  Top 0.254: v30.97,121.87 30.97,114.25 37.32,107.9 37.32,100.28 41.13,96.47 IC6.3 | v126.22,126.95 131.3,132.03 131.3,135.84 ARDUINORIGHT.5
  Bottom 0.254: v30.97,121.87 36.05,126.95 v126.22,126.95
N$34
  Top 0.254: IC7.3 89.39,13.92 95.74,7.57 118.6,7.57 118.6,24.08 123.68,29.16 145.27,29.16 145.27,25.35 146.54,24.08 171.94,24.08 171.94,54.56 187.18,69.8 187.18,82.5 161.78,107.9 156.7,107.9 156.7,132.03 150.35,138.38 133.84,138.38 133.84,135.84 ARDUINORIGHT.6
N$35  (via drill 0.3)
  Top 0.254: v157.97,130.76 157.97,109.17 180.83,109.17 206.23,83.77 206.23,82.5 203.69,79.96 203.69,44.4 206.23,41.86 IC8.3
  Bottom 0.254: v157.97,130.76 137.65,130.76 136.38,132.03 136.38,135.84 ARDUINORIGHT.7
N$36  (via drill 0.3)
  Top 0.254: v53.83,139.65 53.83,121.87 57.64,118.06 RN1.2 57.64,116.79 57.64,111.71 61.45,107.9 61.45,101.55 v63.99,99.01
  Bottom 0.254: v53.83,139.65 48.75,144.73 39.86,144.73 36.05,140.92 S1.2 | v63.99,99.01 76.69,99.01 79.23,96.47 IC1.7
N$37  (via drill 0.3)
  Top 0.254: v52.56,139.65 52.56,120.6 55.1,118.06 RN1.3 55.1,116.79 55.1,102.82 v60.18,97.74
  Bottom 0.254: v52.56,139.65 48.75,143.46 41.13,143.46 38.59,140.92 S1.3 | v60.18,97.74 75.42,97.74 76.69,96.47 IC1.6
N$38  (via drill 0.3)
  Top 0.254: v51.29,139.65 51.29,119.33 52.56,118.06 RN1.4 52.56,116.79 52.56,104.09 v56.37,100.28 | v74.15,100.28 74.15,96.47 IC1.5
  Bottom 0.254: v51.29,139.65 42.4,139.65 41.13,140.92 S1.4 | v56.37,100.28 v74.15,100.28
N$39  (via drill 0.3)
  Top 0.254: 47.48,114.25 50.02,116.79 RN1.5 | 47.48,114.25 32.24,114.25 32.24,128.22 43.67,139.65 43.67,140.92 S1.5 | v71.61,104.09 71.61,96.47 IC1.4 | v51.29,107.9 47.48,111.71 47.48,114.25
  Bottom 0.254: v71.61,104.09 67.8,107.9 v51.29,107.9
N$40  (via drill 0.3)
  Top 0.254: v72.88,106.63 72.88,90.12 71.61,88.85 IC1.13 | S5.2 61.45,140.92 58.91,143.46 50.02,143.46 50.02,120.6 47.48,118.06 RN1.6
  Bottom 0.254: v72.88,106.63 63.99,115.52 48.75,115.52 47.48,116.79 RN1.6
N$41
  Top 0.254: 63.99,143.46 69.07,143.46 74.15,138.38 74.15,125.68 69.07,120.6 69.07,109.17 66.53,106.63 66.53,102.82 67.8,101.55 67.8,90.12 69.07,88.85 IC1.14 | 63.99,143.46 63.99,140.92 S5.3 | 63.99,143.46 63.99,144.73 50.02,144.73 44.94,139.65 44.94,129.49 46.21,128.22 46.21,119.33 44.94,118.06 RN1.7
N$42  (via drill 0.3)
  Top 0.254: S5.4 66.53,140.92 66.53,135.84 v55.1,124.41 67.8,111.71 67.8,109.17 65.26,106.63 65.26,93.93 66.53,92.66 66.53,88.85 IC1.15
  Bottom 0.254: v55.1,124.41 48.75,124.41 42.4,118.06 RN1.8
N$43  (via drill 0.3)
  Top 0.254: v56.37,112.98 56.37,102.82 63.99,95.2 IC1.1 | v67.8,125.68 67.8,139.65 69.07,140.92 S5.5
  Bottom 0.254: v56.37,112.98 43.67,112.98 39.86,116.79 RN1.9 39.86,118.06 41.13,119.33 42.4,119.33 48.75,125.68 v67.8,125.68
N$44  (via drill 0.3)
  Top 0.254: RN2.2 75.42,62.18 v75.42,55.83 75.42,31.7 69.07,25.35 61.45,25.35 S3.2 61.45,29.16
  Bottom 0.254: v75.42,55.83 88.12,55.83 IC2.7
N$45  (via drill 0.3)
  Top 0.254: RN2.3 72.88,62.18 74.15,60.91 v74.15,54.56 74.15,31.7 69.07,26.62 63.99,26.62 63.99,29.16 S3.3
  Bottom 0.254: v74.15,54.56 86.85,54.56 88.12,53.29 IC2.6
N$46  (via drill 0.3)
  Top 0.254: RN2.4 70.34,62.18 v70.34,53.29 66.53,49.48 66.53,29.16 S3.4
  Bottom 0.254: v70.34,53.29 85.58,53.29 88.12,50.75 IC2.5
N$47  (via drill 0.3)
  Top 0.254: v69.07,53.29 69.07,60.91 67.8,62.18 RN2.5 | v72.88,46.94 72.88,32.97 69.07,29.16 S3.5
  Bottom 0.254: 74.15,48.21 v69.07,53.29 | 74.15,48.21 88.12,48.21 IC2.4 | 74.15,48.21 v72.88,46.94
N$48  (via drill 0.3)
  Top 0.254: v67.8,59.64 65.26,62.18 RN2.6
  Bottom 0.254: IC2.13 95.74,48.21 94.47,48.21 94.47,54.56 89.39,59.64 v67.8,59.64 1.76,59.64 1.76,109.17 9.38,116.79 20.81,116.79 20.81,112.98 19.54,111.71 13.19,111.71 11.92,112.98 S2.2
N$49  (via drill 0.3)
  Top 0.254: v24.62,62.18 24.62,91.39 19.54,96.47 19.54,107.9 14.46,112.98 S2.3
  Bottom 0.254: 63.99,60.91 62.72,62.18 RN2.7 | 63.99,60.91 95.74,60.91 98.28,58.37 98.28,45.67 97.01,45.67 IC2.14 | v24.62,62.18 25.89,60.91 63.99,60.91
N$50  (via drill 0.3)
  Top 0.254: v25.89,78.69 25.89,104.09 17,112.98 S2.4
  Bottom 0.254: 62.72,65.99 60.18,63.45 RN2.8 | 62.72,65.99 94.47,65.99 102.09,58.37 102.09,43.13 97.01,43.13 IC2.15 | v25.89,78.69 38.59,65.99 62.72,65.99
N$51  (via drill 0.3)
  Top 0.254: v61.45,52.02 57.64,55.83 57.64,62.18 RN2.9
  Bottom 0.254: v61.45,52.02 67.8,45.67 83.04,45.67 88.12,40.59 IC2.1 | S2.5 18.27,112.98 18.27,115.52 9.38,115.52 3.03,109.17 3.03,63.45 57.64,63.45 RN2.9
N$52
  Top 0.254: OK1.7 190.99,121.87 203.69,121.87 203.69,118.06 R8.P$2
N$53  (via drill 0.3)
  Top 0.254: v79.23,100.28 74.15,105.36 74.15,116.79 RN3.2
  Bottom 0.254: RN3.2 74.15,116.79 71.61,119.33 60.18,119.33 56.37,123.14 56.37,124.41 67.8,124.41 69.07,123.14 S5.6 | v79.23,100.28 114.79,100.28 114.79,93.93 112.25,91.39 IC4.7
N$54  (via drill 0.3)
  Top 0.254: v84.31,88.85 80.5,92.66 80.5,112.98 76.69,116.79 RN3.3
  Bottom 0.254: RN3.3 76.69,116.79 72.88,120.6 67.8,120.6 66.53,121.87 S5.7 | v84.31,88.85 98.28,88.85 102.09,92.66 109.71,92.66 110.98,93.93 IC4.6
N$55  (via drill 0.3)
  Top 0.254: RN3.4 79.23,116.79 79.23,125.68 85.58,132.03 85.58,140.92 S6.2 | v107.17,115.52 107.17,100.28 110.98,96.47 IC4.5
  Bottom 0.254: v107.17,115.52 103.36,119.33 80.5,119.33 79.23,118.06 79.23,116.79 RN3.4
N$56  (via drill 0.3)
  Top 0.254: 81.77,116.79 81.77,126.95 88.12,133.3 88.12,140.92 S6.3 | v85.58,97.74 81.77,101.55 81.77,116.79 | 81.77,116.79 RN3.5
  Bottom 0.254: v85.58,97.74 109.71,97.74 110.98,99.01 IC4.4
N$57  (via drill 0.3)
  Top 0.254: 99.55,111.71 102.09,109.17 102.09,100.28 103.36,99.01 IC4.13 | 99.55,111.71 v98.28,112.98 | 99.55,111.71 99.55,143.46 93.2,143.46 91.93,142.19 91.93,140.92 S6.4
  Bottom 0.254: v98.28,112.98 88.12,112.98 84.31,116.79 RN3.6
N$58
  Top 0.254: 235.44,146 235.44,148.54 W1.P2C | 235.44,146 231.63,142.19 231.63,130.76 D2.A | 235.44,146 W1.P1C
N$59  (via drill 0.3)
  Top 0.254: 95.74,106.63 94.47,106.63 93.2,107.9 93.2,112.98 90.66,112.98 86.85,116.79 RN3.7 | 95.74,106.63 95.74,128.22 94.47,129.49 94.47,140.92 S6.5 | 95.74,106.63 v95.74,102.82
  Bottom 0.254: v95.74,102.82 102.09,102.82 103.36,101.55 IC4.14
N$60  (via drill 0.3)
  Top 0.254: RN3.8 89.39,116.79 91.93,114.25 93.2,114.25 93.2,123.14 S6.6 94.47,123.14 v94.47,107.9
  Bottom 0.254: v94.47,107.9 97.01,105.36 102.09,105.36 103.36,104.09 IC4.15
N$61  (via drill 0.3)
  Top 0.254: 163.05,146 163.05,148.54 W2.PA4 | 163.05,146 161.78,144.73 v161.78,140.92 | 163.05,146 W2.PA8
  Bottom 0.254: 124.95,137.11 126.22,135.84 ARDUINORIGHT.3 | 124.95,137.11 123.68,138.38 118.6,138.38 110.98,146 SV1.1 | v161.78,140.92 157.97,137.11 124.95,137.11
N$62
  Top 0.254: L1.A 234.17,140.92 236.71,138.38 236.71,125.68 R1.P$2
N$63  (via drill 0.3)
  Top 0.254: 160.51,146 160.51,148.54 W2.PA3 | v105.9,137.11 105.9,142.19 107.17,143.46 SV1.4 | v160.51,132.03 160.51,146 | 160.51,146 W2.PA7
  Bottom 0.254: 117.33,137.11 122.41,137.11 123.68,135.84 ARDUINORIGHT.2 | 117.33,137.11 v105.9,137.11 | v160.51,132.03 157.97,129.49 124.95,129.49 117.33,137.11
N$64
  Bottom 0.254: IC5.15 213.85,99.01 218.93,104.09 218.93,115.52 236.71,115.52 239.25,118.06 R2.P$2
N$65
  Top 0.254: L2.A 243.06,39.32 235.44,46.94 235.44,107.9 237.98,110.44 237.98,114.25 235.44,116.79 235.44,121.87 239.25,125.68 R2.P$1
N$66  (via drill 0.3)
  Top 0.254: v116.06,101.55 114.79,102.82 114.79,129.49 121.14,135.84 ARDUINORIGHT.1
  Bottom 0.254: v116.06,101.55 207.5,101.55 212.58,96.47 IC5.14
N$67
  Top 0.254: W1.P1T2 237.98,146 237.98,148.54 W1.P2T2
  Bottom 0.254: W1.P1T2 237.98,146 237.98,142.19 239.25,140.92 239.25,137.11 222.74,137.11 DC.PWR
N$68
  Top 0.254: L3.A 243.06,57.1 236.71,57.1 236.71,99.01 241.79,104.09 241.79,124.41 243.06,125.68 R3.P$1
N$69
  Top 0.254: 112.25,140.92 108.44,137.11 108.44,102.82 113.52,102.82 114.79,101.55 114.79,90.12 100.82,90.12 90.66,79.96 90.66,46.94 89.39,45.67 IC2.3 | 112.25,140.92 112.25,142.19 110.98,143.46 SV1.3 | 112.25,140.92 123.68,140.92 128.76,135.84 ARDUINORIGHT.4
N$70
  Bottom 0.254: R7.P$1 164.32,128.22 169.4,133.3 185.91,133.3 187.18,134.57 MIDI-IN.4
N$71
  Top 0.254: MIDI-IN.5 177.02,134.57 179.56,132.03 179.56,126.95 182.1,124.41 OK1.3
  Bottom 0.254: D1.A 170.67,120.6 174.48,124.41 182.1,124.41 OK1.3
N$72
  Top 0.254: C1.1 220.2,112.98 220.2,126.95 221.47,128.22 IC9.1
  Bottom 0.254: IC9.1 222.74,128.22 227.82,123.14 231.63,123.14 D2.C
N$73
  Top 0.254: OK1.6 190.99,124.41 201.15,124.41 R9.P$2
  Bottom 0.254: ARDUINOLEFT.2 146.54,120.6 151.62,125.68 201.15,125.68 R9.P$2
N$74
  Top 0.254: R5.P$2 210.04,125.68 201.15,134.57 197.34,134.57 MIDI-OUT.5
N$75
  Bottom 0.254: ARDUINOLEFT.1 149.08,120.6 152.89,116.79 198.61,116.79 199.88,115.52 208.77,115.52 210.04,116.79 R5.P$1
N$76
  Top 0.254: R6.P$2 213.85,125.68 207.5,132.03 207.5,134.57 MIDI-OUT.4
N$77  (via drill 0.3)
  Top 0.254: v109.71,111.71 109.71,107.9 110.98,106.63 IC4.1 | S6.7 91.93,123.14 91.93,116.79 RN3.9
  Bottom 0.254: v109.71,111.71 104.63,116.79 91.93,116.79 RN3.9
N$78
  Bottom 0.254: IC3.7 119.87,59.64 123.68,63.45 147.81,63.45 151.62,59.64 RN4.2 152.89,59.64 217.66,59.64 224.01,53.29 246.87,53.29 246.87,27.89 239.25,20.27 239.25,17.73 T1.1
N$79  (via drill 0.3)
  Top 0.254: v123.68,65.99 123.68,60.91 119.87,57.1 IC3.6 | v150.35,65.99 154.16,62.18 154.16,58.37 152.89,57.1 RN4.3
  Bottom 0.254: v150.35,65.99 v123.68,65.99 | T2.1 239.25,36.78 218.93,57.1 213.85,57.1 212.58,55.83 208.77,55.83 207.5,57.1 152.89,57.1 RN4.3
N$80  (via drill 0.3)
  Top 0.254: v155.43,64.72 155.43,58.37 152.89,55.83 152.89,54.56 RN4.4
  Bottom 0.254: IC3.5 118.6,54.56 114.79,58.37 114.79,64.72 v155.43,64.72 230.36,64.72 239.25,55.83 T3.1
N$81  (via drill 0.3)
  Top 0.254: IC3.4 119.87,52.02 124.95,46.94 124.95,43.13 126.22,41.86 131.3,41.86 131.3,44.4 135.11,48.21 135.11,50.75 136.38,52.02 v145.27,52.02 v145.27,68.53
  Bottom 0.254: v145.27,52.02 151.62,52.02 RN4.5 | v145.27,68.53 227.82,68.53 239.25,79.96 T4.1
N$82
  Bottom 0.254: IC5.1 221.47,101.55 227.82,107.9 236.71,107.9 243.06,114.25 243.06,118.06 R3.P$2
N$83
  Bottom 0.254: IC5.2 221.47,99.01 224.01,101.55 231.63,101.55 245.6,115.52 246.87,115.52 248.14,116.79 248.14,125.68 246.87,125.68 R4.P$2
N$84
  Top 0.254: L4.A 243.06,83.77 245.6,86.31 245.6,118.06 R4.P$1
N$85
  Top 0.254: 169.4,125.68 164.32,120.6 R7.P$2 | 169.4,125.68 170.67,126.95 D1.C | 169.4,125.68 171.94,123.14 171.94,121.87 182.1,121.87 OK1.2
N$86  (via drill 0.3)
  Top 0.254: RN4.6 152.89,49.48 154.16,50.75 v154.16,53.29 154.16,55.83 173.21,74.88 173.21,85.04 S4.2
  Bottom 0.254: v154.16,53.29 128.76,53.29 127.49,52.02 IC3.13
N$87
  Top 0.254: S4.3 175.75,85.04 175.75,76.15 155.43,55.83 155.43,49.48 152.89,46.94 RN4.7
  Bottom 0.254: IC3.14 127.49,49.48 130.03,46.94 151.62,46.94 RN4.7
N$88
  Top 0.254: S4.4 178.29,85.04 178.29,77.42 156.7,55.83 156.7,48.21 152.89,44.4 RN4.8
  Bottom 0.254: IC3.15 127.49,46.94 128.76,45.67 150.35,45.67 151.62,44.4 RN4.8
N$89  (via drill 0.3)
  Top 0.254: v137.65,40.59 123.68,40.59 119.87,44.4 IC3.1 | S4.5 180.83,85.04 180.83,78.69 157.97,55.83 157.97,46.94 152.89,41.86 RN4.9
  Bottom 0.254: v137.65,40.59 150.35,40.59 151.62,41.86 RN4.9
N$90
  Bottom 0.254: SV1.5 109.71,140.92 107.17,138.38 105.9,138.38 104.63,137.11 104.63,128.22 136.38,128.22 144,120.6 ARDUINOLEFT.3
SR5  (via drill 0.3)
  Top 0.254: v70.34,101.55 70.34,97.74 69.07,96.47 IC1.3 | v130.03,107.9 132.57,110.44 132.57,119.33 131.3,120.6 ARDUINOLEFT.8
  Bottom 0.254: v70.34,101.55 76.69,107.9 93.2,107.9 94.47,109.17 123.68,109.17 124.95,107.9 v130.03,107.9
SR6  (via drill 0.3)
  Top 0.254: IC3.9 127.49,62.18 128.76,63.45 128.76,79.96 131.3,82.5 v131.3,90.12 131.3,100.28 128.76,102.82 128.76,107.9 131.3,110.44 131.3,118.06 128.76,120.6 ARDUINOLEFT.9 | v99.55,85.04 99.55,60.91 97.01,58.37 IC2.9
  Bottom 0.254: IC1.9 81.77,87.58 84.31,85.04 v99.55,85.04 103.36,88.85 IC4.9 104.63,88.85 105.9,90.12 v131.3,90.12 211.31,90.12 212.58,91.39 IC5.12
SR7  (via drill 0.3)
  Top 0.254: v100.82,88.85 100.82,59.64 97.01,55.83 IC2.10 | IC3.10 126.22,59.64 124.95,60.91 124.95,79.96 122.41,82.5 v122.41,88.85 122.41,101.55 124.95,104.09 124.95,107.9 122.41,110.44 122.41,116.79 126.22,120.6 ARDUINOLEFT.10 | v97.01,120.6 97.01,91.39 103.36,91.39 IC4.10
  Bottom 0.254: IC4.10 103.36,91.39 v100.82,88.85 99.55,87.58 83.04,87.58 83.04,90.12 80.5,90.12 79.23,88.85 IC1.10 | v122.41,88.85 212.58,88.85 IC5.11 | v97.01,120.6 98.28,121.87 124.95,121.87 126.22,120.6 ARDUINOLEFT.10
SR8  (via drill 0.3)
  Top 0.254: v116.06,118.06 116.06,116.79 117.33,115.52 117.33,91.39 109.71,83.77 109.71,73.61 110.98,72.34 110.98,49.48 118.6,49.48 IC3.3
  Bottom 0.254: v116.06,118.06 121.14,118.06 123.68,120.6 ARDUINOLEFT.11
SR9  (via drill 0.3)
  Top 0.254: v119.87,106.63 121.14,107.9 121.14,120.6 ARDUINOLEFT.12
  Bottom 0.254: v119.87,106.63 117.33,106.63 112.25,101.55 IC4.3
VCC  (via drill 0.3)
  Top 0.254: P16.P$3 37.32,26.62 37.32,54.56 P14.P$3 | 11.92,54.56 11.92,26.62 P09.P$3 | 11.92,54.56 11.92,82.5 P02.P$3 11.92,83.77 3.03,92.66 3.03,129.49 11.92,138.38 P06.P$3 | 11.92,54.56 P15.P$3 | 97.01,10.11 IC7.16 95.74,10.11 94.47,11.38 94.47,30.43 | 94.47,30.43 94.47,38.05 | 94.47,38.05 94.47,39.32 95.74,40.59 IC2.16 | 94.47,30.43 C3.1 | IC6.16 36.05,87.58 36.05,83.77 P01.P$3 | P03.P$3 61.45,86.31 | 61.45,86.31 61.45,87.58 63.99,87.58 IC1.16 | 61.45,86.31 57.64,90.12 C2.1 | 85.58,46.94 77.96,54.56 77.96,62.18 RN2.1 77.96,63.45 86.85,72.34 86.85,82.5 P05.P$3 86.85,83.77 86.85,90.12 85.58,91.39 C8.1 | 94.47,38.05 85.58,38.05 85.58,46.94 | 85.58,46.94 C7.1 | 212.58,86.31 211.31,85.04 211.31,58.37 C4.1 | 201.15,115.52 201.15,116.79 R9.P$1 | 201.15,115.52 201.15,114.25 198.61,111.71 P20.P$3 | P18.P$3 230.36,111.71 222.74,119.33 222.74,123.14 IC9.3 | 201.15,115.52 212.58,115.52 212.58,116.79 R6.P$1 | 212.58,86.31 211.31,87.58 211.31,100.28 212.58,101.55 IC5.16 | 212.58,86.31 IC5.10 | 156.7,34.24 161.78,39.32 161.78,49.48 P17.P$3 | 156.7,34.24 149.08,26.62 P24.P$3 | 215.12,36.78 IC8.16 | P23.P$3 185.91,49.48 174.48,38.05 174.48,26.62 P21.P$3 | IC4.16 104.63,106.63 104.63,143.46 107.17,146 SV1.2 | v100.82,106.63 100.82,96.47 C5.1 | P07.P$3 61.45,115.52 60.18,116.79 RN1.1 | 149.08,64.72 151.62,62.18 RN4.1 | 149.08,64.72 149.08,82.5 P25.P$3 149.08,83.77 149.08,110.44 P27.P$3 | v152.89,114.25 152.89,124.41 141.46,135.84 ARDUINORIGHT.9 | 156.7,34.24 149.08,41.86 149.08,64.72
  Bottom 0.254: P12.P$3 61.45,55.83 60.18,57.1 37.32,57.1 36.05,55.83 P14.P$3 | P16.P$3 36.05,26.62 34.78,25.35 13.19,25.35 11.92,26.62 P09.P$3 | 105.9,40.59 97.01,40.59 IC2.16 | 105.9,40.59 116.06,40.59 | 116.06,40.59 122.41,40.59 126.22,44.4 IC3.16 | 116.06,40.59 116.06,53.29 C6.1 | 123.68,26.62 119.87,30.43 94.47,30.43 C3.1 | 105.9,40.59 105.9,43.13 P11.P$3 | IC6.16 36.05,88.85 38.59,91.39 55.1,91.39 56.37,90.12 C2.1 | IC1.16 63.99,88.85 66.53,91.39 84.31,91.39 C8.1 | P02.P$3 11.92,82.5 13.19,81.23 34.78,81.23 36.05,82.5 P01.P$3 | C9.1 216.39,81.23 199.88,81.23 198.61,82.5 P19.P$3 198.61,83.77 201.15,86.31 212.58,86.31 IC5.10 | OK1.8 190.99,119.33 192.26,118.06 201.15,118.06 R9.P$1 | IC5.16 213.85,101.55 213.85,116.79 R6.P$1 213.85,118.06 216.39,118.06 218.93,120.6 | 218.93,120.6 221.47,123.14 IC9.3 | 218.93,120.6 234.17,120.6 236.71,118.06 R1.P$1 | P10.P$3 136.38,50.75 137.65,52.02 144,52.02 145.27,50.75 161.78,50.75 P17.P$3 | 198.61,26.62 201.15,29.16 206.23,29.16 213.85,36.78 IC8.16 | 175.75,25.35 174.48,26.62 P21.P$3 | 175.75,25.35 197.34,25.35 198.61,26.62 | 198.61,26.62 P22.P$3 | 150.35,25.35 149.08,26.62 P24.P$3 | 175.75,25.35 150.35,25.35 | v100.82,106.63 103.36,106.63 IC4.16 104.63,106.63 105.9,107.9 123.68,107.9 124.95,106.63 130.03,106.63 132.57,109.17 | 71.61,116.79 60.18,116.79 RN1.1 | P04.P$3 36.05,110.44 37.32,109.17 60.18,109.17 61.45,110.44 P07.P$3 | 71.61,116.79 74.15,114.25 84.31,114.25 86.85,111.71 P08.P$3 86.85,110.44 88.12,109.17 93.2,109.17 94.47,110.44 123.68,110.44 | 71.61,116.79 RN3.1 | P29.P$3 123.68,82.5 124.95,81.23 147.81,81.23 149.08,82.5 P25.P$3
  Bottom 0.254: 123.68,110.44 124.95,109.17 132.57,109.17 | 147.81,109.17 132.57,109.17 | 147.81,109.17 149.08,110.44 P27.P$3 149.08,111.71 150.35,112.98 151.62,112.98 v152.89,114.25 | 171.94,109.17 173.21,110.44 P26.P$3 | 147.81,109.17 171.94,109.17 | 123.68,110.44 P28.P$3 | 171.94,109.17 197.34,109.17 198.61,110.44 P20.P$3 | 123.68,26.62 124.95,25.35 150.35,25.35 | 123.68,26.62 P13.P$3

### Text on the board
tPlace: + | + | + | + | Oct 12/15
tNames: JunoCTRL | v1.3 | www.midiclub.net | Dylan Morrison | Silviu Toderita